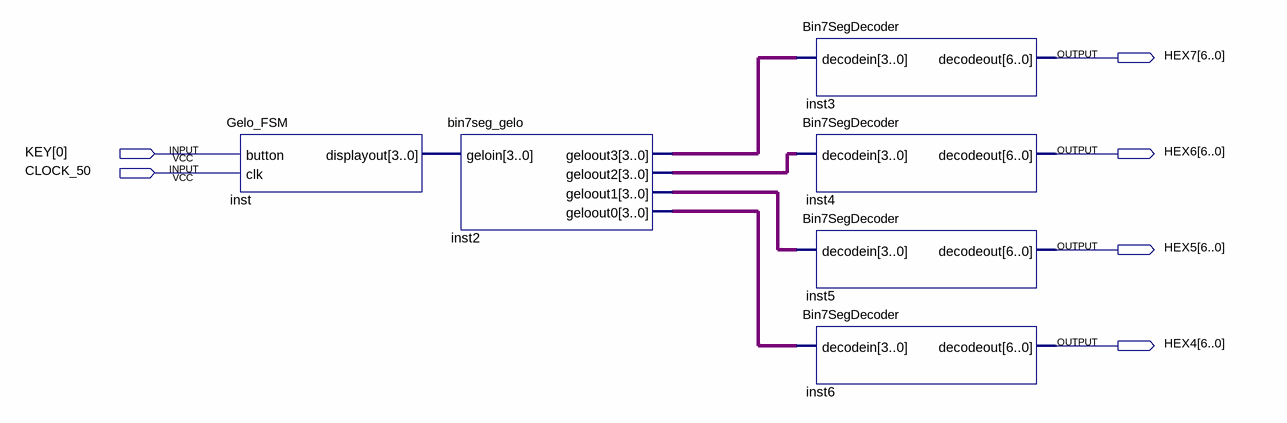
[diagram p0: schematic sheet]
// Quartus schematic Gelo_Block.bdf as structural Verilog: 6 symbols, 6 pins
module Gelo_Block (
  input  [0:0] KEY,
  input  CLOCK_50,
  output [6:0] HEX7,
  output [6:0] HEX6,
  output [6:0] HEX5,
  output [6:0] HEX4
);

  wire [3:0] inst2_geloout0, inst2_geloout1, inst2_geloout2, inst2_geloout3, inst_displayout;

  Gelo_FSM inst (.button(KEY[0]), .clk(CLOCK_50), .displayout(inst_displayout));
  bin7seg_gelo inst2 (
    .geloin(inst_displayout), .geloout3(inst2_geloout3), .geloout2(inst2_geloout2),
    .geloout1(inst2_geloout1), .geloout0(inst2_geloout0));
  Bin7SegDecoder inst3 (.decodein(inst2_geloout3), .decodeout(HEX7));
  Bin7SegDecoder inst4 (.decodein(inst2_geloout2), .decodeout(HEX6));
  Bin7SegDecoder inst5 (.decodein(inst2_geloout1), .decodeout(HEX5));
  Bin7SegDecoder inst6 (.decodein(inst2_geloout0), .decodeout(HEX4));
endmodule
